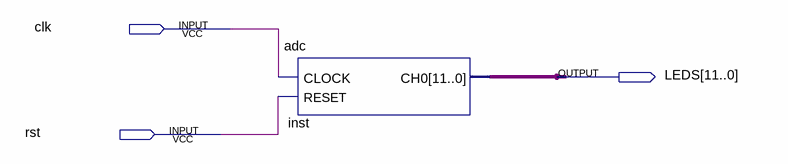
[diagram p0: schematic sheet]
// Quartus schematic adc_1.bdf as structural Verilog: 1 symbols, 3 pins
module adc_1 (
  input  clk,
  input  rst,
  output [11:0] LEDS
);

  adc inst (.CLOCK(clk), .RESET(rst), .CH0(LEDS));
endmodule
